# EasyEDA Pro project FKM3.epro, schematic Schematic2
Board Name: RfidScanner; Create Date: 2025-02-13; Page Name: P1; Project Name: fkm3; Schematic Name: Schematic2; Update Date: 2025-02-13; Company: EasyEDA.com; Drawn: EasyEDA; Page Size: A4; Part Number: JLCPCB-002; Reviewed: EasyEDA; Version: V0.1
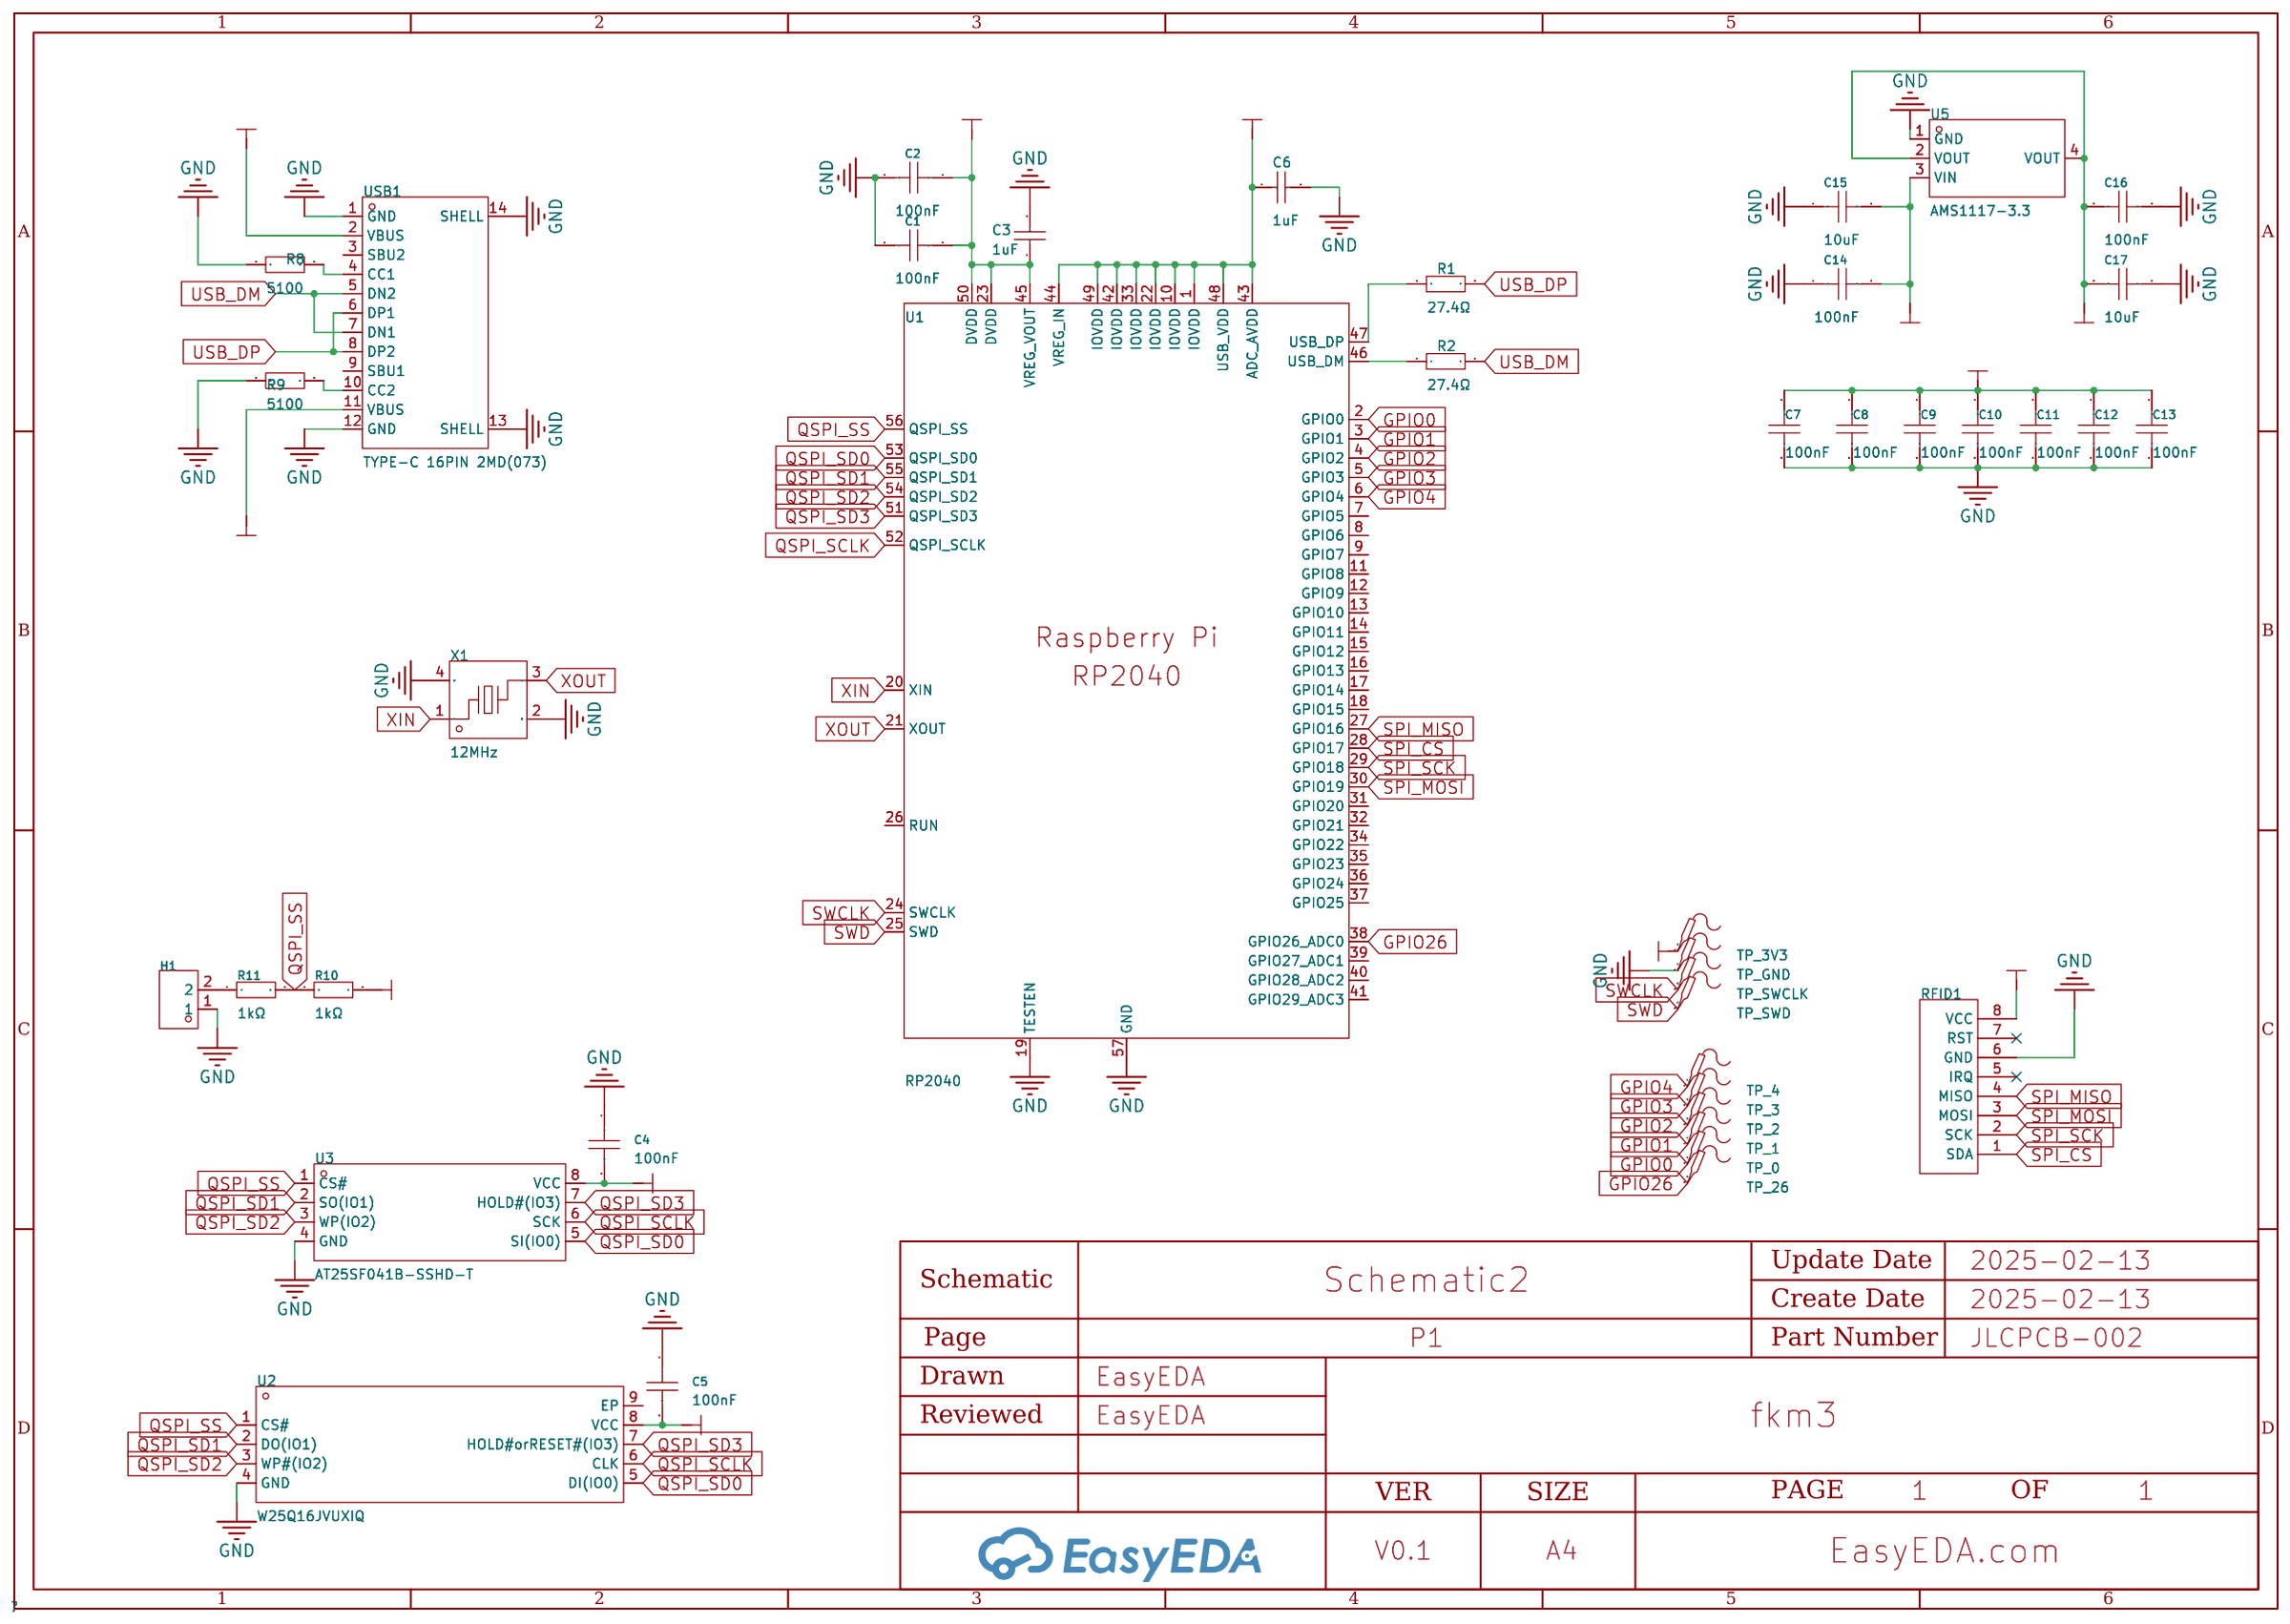
[diagram p2: schematic sheet]

## Parts
C1  100nF  [C0603]
C2  100nF  [C0603]
C3  1uF  [C0603]
C4  100nF  [C0603]
C5  100nF  [C0603]
C6  1uF  [C0603]
C7  100nF  [C0603]
C8  100nF  [C0603]
C9  100nF  [C0603]
C10  100nF  [C0603]
C11  100nF  [C0603]
C12  100nF  [C0603]
C13  100nF  [C0603]
C14  100nF  [C0603]
C15  10uF  [C0603]
C16  100nF  [C0603]
C17  10uF  [C0603]
H1  PZ254V-11-02P  [HDR-TH_2P-P2.54-V-M]
R1  27.4Ω  [R0402]
R2  27.4Ω  [R0402]
R8  5100  [R0603]
R9  5100  [R0603]
R10  1kΩ  [R0402]
R11  1kΩ  [R0402]
RFID1  -  [RFID-RC522-Board]
TP_0  -  [Test-Point-0.5mm]
TP_1  -  [Test-Point-0.5mm]
TP_2  -  [Test-Point-0.5mm]
TP_3  -  [Test-Point-0.5mm]
TP_3V3  -  [Test-Point-0.5mm]
TP_4  -  [Test-Point-0.5mm]
TP_26  -  [Test-Point-0.5mm]
TP_GND  -  [Test-Point-0.5mm]
TP_SWCLK  -  [Test-Point-0.5mm]
TP_SWD  -  [Test-Point-0.5mm]
U1  RP2040  [LQFN-56_L7.0-W7.0-P0.4-EP]
U2  W25Q16JVUXIQ  [USON-8_L3.0-W2.0-P0.50-BL-EP]
U3  AT25SF041B-SSHD-T  [SOIC-8_L4.9-W3.9-P1.27-LS6.0-BL]
U5  AMS1117-3.3  [SOT-223-3_L6.5-W3.4-P2.30-LS7.0-BR]
USB1  TYPE-C 16PIN 2MD(073)  [USB-C-SMD_TYPE-C-6PIN-2MD-073]
X1  12MHz  [CRYSTAL-SMD_4P-L3.2-W2.5-BL]

## Library data of the parts
C1 C2 C4 C5 C7-C14 C16 = CL10B104KB8NNNC: Capacitance: Tolerance:±10% Tolerance:±10% Voltage Rated: Temperature Coefficient:; LCSC Part Name: 100nF ±10% 50V; Supplier Part: C1591; Manufacturer: SAMSUNG(三星); Supplier Footprint: 0603; JLCPCB Part Class: Extended Part; Datasheet: https://atta.szlcsc.com/upload/public/pdf/source/20160218/1457707763339.pdf; Supplier: LCSC; Tolerance: ±10%
C3 C6 = CL10A105KA8NNNC: Capacitance: Tolerance:±10% Tolerance:±10% Voltage Rated: Temperature Coefficient:; LCSC Part Name: 1uF ±10% 25V; Supplier Part: C5673; Manufacturer: SAMSUNG(三星); Supplier Footprint: 0603; JLCPCB Part Class: Extended Part; Datasheet: https://atta.szlcsc.com/upload/public/pdf/source/20160218/1457707763339.pdf; Supplier: LCSC; Tolerance: ±10%
C15 C17 = CL10A106KP8NNNC: Capacitance: Tolerance:±10% Tolerance:±10% Voltage Rated: Temperature Coefficient:; LCSC Part Name: 10uF ±10% 10V; Supplier Part: C19702; Manufacturer: SAMSUNG(三星); Supplier Footprint: 0603; JLCPCB Part Class: Basic Part; Datasheet: https://atta.szlcsc.com/upload/public/pdf/source/20160218/1457707763339.pdf; Supplier: LCSC; Tolerance: ±10%
H1 = PZ254V-11-02P: Pin Structure:1x2P Pitch:2.54mm Row Spacing:- Circluar Pins/Square Pins:Square Pins Mounting Type:Straight Number of Rows:Plugin Number of Pins:2P Current Rating (Max):- Voltage Rating (Max):- Length of Mating Pin:6mm Insulation Height:2.5mm Length of End; LCSC Part Name: 间距:2.54mm 1x2P 直插 方针; Supplier Part: C492401; Manufacturer: XFCN(兴飞); Supplier Footprint: 插件,P=2.54mm; JLCPCB Part Class: Extended Part; Datasheet: https://atta.szlcsc.com/upload/public/pdf/source/20200309/C492401_A812433581A9B211A7FFA413ADDFF0E5.pdf; Supplier: LCSC; Pin Structure: 1x2P; Pitch: 2.54mm; Circluar Pins/Square Pins: Square Pins; Mounting Type: Straight; Number of Rows: Plugin; Number of Pins: 2P; Length of Mating Pin: 6mm; Insulation Height: 2.5mm; Length of End Connection Pin: 3mm; Operating Temperature Range: -40℃~+105℃; Color: Black
R1 R2 = RC0402FR-0727R4L: Type:Thick Film Resistors Resistance: Tolerance:±1% Tolerance:±1% Power(Watts): Overload Voltage (Max): Temperature Coefficient:±100ppm/℃ Temperature Coefficient:±100ppm/℃ Operating Temperature Range:-55℃~+155℃ Operating Temperature Range:-55℃~+155℃; LCSC Part Name: 厚膜电阻 27.4Ω ±1% 62.5mW; Supplier Part: C274349; Manufacturer: YAGEO(国巨); Supplier Footprint: 0402; JLCPCB Part Class: Extended Part; Datasheet: https://atta.szlcsc.com/upload/public/pdf/source/20180821/C275644_0D56F95EFF785E7D9A1FEF436B37DA78.pdf; Supplier: LCSC; Type: Thick Film Resistors; Tolerance: ±1%; Temperature Coefficient: ±100ppm/℃; Operating Temperature Range: -55℃~+155℃
R8 R9 = Res_0603: Supplier Footprint: 0603
R10 R11 = 0402WGF1001TCE: Type:Thick Film Resistors Resistance:1kΩ Tolerance:±1% Tolerance:±1% Power(Watts): Overload Voltage (Max): Temperature Coefficient:±100ppm/℃ Temperature Coefficient:±100ppm/℃ Operating Temperature Range:-55℃~+155℃ Operating Temperature Range:-55℃~+155℃; LCSC Part Name: 1kΩ ±1% 62.5mW 厚膜电阻; Supplier Part: C11702; Manufacturer: UNI-ROYAL(厚声); Supplier Footprint: 0402; JLCPCB Part Class: Basic Part; Datasheet: https://atta.szlcsc.com/upload/public/pdf/source/20200306/C422600_1E6D84923E4A46A82E41ADD87F860B5C.pdf; Supplier: LCSC; Type: Thick Film Resistors; Tolerance: ±1%; Temperature Coefficient: ±100ppm/℃; Operating Temperature Range: -55℃~+155℃
RFID1 = RFID-RC522-Board
TP_0-TP_3 TP_3V3 TP_4 TP_26 TP_GND TP_SWCLK TP_SWD = Test-Point: Test Point 测试点
U1 = RP2040_C2040: CPU Core:- RAM Size:264KB GPIO Ports Number:30 Operating Voltage Range:- Operating Voltage Range:- CPU Maximum Speed:133MHz Program Memory Type:- Operating Temperature Range:- Operating Temperature Range:- ADC (Bit):12bit DAC (Bit):- PWM (Bit):- 8Bit Time; LCSC Part Name: RP2040（RP2B2）; Supplier Part: C2040; Manufacturer: Raspberry Pi(树莓派); Supplier Footprint: LQFN-56(7x7); JLCPCB Part Class: Extended Part; Datasheet: https://atta.szlcsc.com/upload/public/pdf/source/20210621/C2040_96F425825606B7957D87DD32E2512CA9.pdf; Supplier: LCSC; RAM Size: 264KB; GPIO Ports Number: 30; CPU Maximum Speed: 133MHz; ADC (Bit): 12bit; UART/USART: 2; I2C: 2; SPI: 2; Universal Serial Bus: 有; Peripheral/Function: DMA；PWM; Direct Memory Access: 有
U2 = W25Q16JVUXIQ: Supplier Part: C2843335; Manufacturer: WINBOND(华邦); Supplier Footprint: USON-8-EP(2x3); JLCPCB Part Class: Extended Part; Datasheet: https://atta.szlcsc.com/upload/public/pdf/source/20210629/C2843335_FB4D78B5076715625DC0C83F790D3044.pdf; Supplier: LCSC
U3 = AT25SF041B-SSHD-T: Supplier Part: C5127618; Manufacturer: RENESAS(瑞萨)/IDT; Supplier Footprint: SOIC-8; JLCPCB Part Class: Extended Part; Datasheet: https://atta.szlcsc.com/upload/public/pdf/source/20220812/6FA76D54DDD5F49F6B0F271FB086CE90.pdf; Supplier: LCSC
U5 = AMS1117-3.3_C6186: Output Type: Maximum Input Voltage:- Output Voltage:3.3V Output Voltage:3.3V MAX Output Current:1A Power Supply Rejection Ratio (PSRR):72dB@(120Hz) Dropout Voltage:1.3V@(800mA) standby current:- Noise:- Feature:- Operating Temperature:- Operating Temperat; LCSC Part Name: 输出3.3V 1A; Supplier Part: C6186; Manufacturer: AMS; Supplier Footprint: SOT-223; JLCPCB Part Class: Basic Part; Datasheet: https://atta.szlcsc.com/upload/public/pdf/source/20180727/C6186_7A095716F0823C02F1997A905E26C086.pdf; Supplier: LCSC; Output Voltage: 3.3V; MAX Output Current: 1A; Power Supply Rejection Ratio (PSRR): 72dB@(120Hz); Dropout Voltage: 1.3V@(800mA); Output Polarity: Positive electrode; Number of Outputs: 1
USB1 = TYPE-C 16PIN 2MD(073): Connector Type:Type-C Standard:USB 3.1 Gender:Female Mounting Style:Horizontal attachment Number of Contacts:16P Number of Ports:1 Current Rating - Power (Max):5A Operating Temperature Range:-25℃~+85℃ Operating Temperature Range:-25℃~+85℃ Rated Voltage (M; LCSC Part Name: Type-C 母 卧贴; Supplier Part: C2765186; Manufacturer: SHOU HAN(首韩); Supplier Footprint: SMD; JLCPCB Part Class: Extended Part; Datasheet: https://atta.szlcsc.com/upload/public/pdf/source/20211123/39B17C16241EAC15C5E277BDA434118E.pdf; Supplier: LCSC; Connector Type: Type-C; Standard: USB 3.1; Gender: Female; Mounting Style: Horizontal attachment; Number of Contacts: 16P; Number of Ports: 1; Current Rating - Power (Max): 5A; Operating Temperature Range: -25℃~+85℃; Rated Voltage (Max): 5V; Connect-Disconnect Life: 5000 Cuts; Core Colour: Black
X1 = 3225-12.00-12-10-10/A: Crystal Type:贴片晶振 Frequency: Normal temperature Frequency Tolerance:±10ppm Normal temperature Frequency Tolerance:±10ppm External load capacitor: Frequency Stability(Full temperature range):±10ppm Frequency Stability(Full temperature range):±10ppm Equival; LCSC Part Name: 12MHz ±10ppm 12pF; Supplier Part: C518158; Manufacturer: LIMING(利明); Supplier Footprint: SMD3225-4P; JLCPCB Part Class: Extended Part; Datasheet: https://atta.szlcsc.com/upload/public/pdf/source/20200603/C518143_C28693AFC6B5677A46756E3C75F63174.pdf; Supplier: LCSC; Crystal Type: 贴片晶振; Normal temperature Frequency Tolerance: ±10ppm; Frequency Stability(Full temperature range): ±10ppm

## Nets
+1V1: C1.1 C2.1 C3.1 U1.23(DVDD) U1.45(VREG_VOUT) U1.50(DVDD)
+3V3: C4.2 C5.2 C6.2 C7.1 C8.1 C9.1 C10.1 C11.1 C12.1 C13.1 C16.2 C17.2 R10.2 RFID1.8(VCC) TP_3V3.1 U1.1(IOVDD) U1.10(IOVDD) U1.22(IOVDD) U1.33(IOVDD) U1.42(IOVDD) U1.43(ADC_AVDD) U1.44(VREG_IN) U1.48(USB_VDD) U1.49(IOVDD) U2.8(VCC) U3.8(VCC) U5.2(VOUT) U5.4(VOUT)
GND: C1.2 C2.2 C3.2 C4.1 C5.1 C6.1 C7.2 C8.2 C9.2 C10.2 C11.2 C12.2 C13.2 C14.1 C15.1 C16.1 C17.1 H1.1 R8.1 R9.1 RFID1.6(GND) TP_GND.1 U1.19(TESTEN) U1.57(GND) U2.4(GND) U3.4(GND) U5.1(GND) USB1.1(GND) USB1.12(GND) USB1.13(SHELL) USB1.14(SHELL) X1.2(GND) X1.4(GND)
GPIO0: TP_0.1 U1.2(GPIO0)
GPIO1: TP_1.1 U1.3(GPIO1)
GPIO2: TP_2.1 U1.4(GPIO2)
GPIO3: TP_3.1 U1.5(GPIO3)
GPIO4: TP_4.1 U1.6(GPIO4)
GPIO26: TP_26.1 U1.38(GPIO26_ADC0)
QSPI_SCLK: U1.52(QSPI_SCLK) U2.6(CLK) U3.6(SCK)
QSPI_SD0: U1.53(QSPI_SD0) U2.5(DI(IO0)) U3.5(SI(IO0))
QSPI_SD1: U1.55(QSPI_SD1) U2.2(DO(IO1)) U3.2(SO(IO1))
QSPI_SD2: U1.54(QSPI_SD2) U2.3(WP#(IO2)) U3.3(WP(IO2))
QSPI_SD3: U1.51(QSPI_SD3) U2.7(HOLD#orRESET#(IO3)) U3.7(HOLD#(IO3))
QSPI_SS: R10.1 R11.2 U1.56(QSPI_SS) U2.1(CS#) U3.1(CS#)
SPI_CS: RFID1.1(SDA) U1.28(GPIO17)
SPI_MISO: RFID1.4(MISO) U1.27(GPIO16)
SPI_MOSI: RFID1.3(MOSI) U1.30(GPIO19)
SPI_SCK: RFID1.2(SCK) U1.29(GPIO18)
SWCLK: TP_SWCLK.1 U1.24(SWCLK)
SWD: TP_SWD.1 U1.25(SWD)
USB_DM: R2.2 USB1.5(DN2) USB1.7(DN1)
USB_DP: R1.2 USB1.6(DP1) USB1.8(DP2)
VUSB: C14.2 C15.2 U5.3(VIN) USB1.2(VBUS) USB1.11(VBUS)
XIN: U1.20(XIN) X1.1
XOUT: U1.21(XOUT) X1.3
$1N1062: R1.1 U1.47(USB_DP)
$1N1101: R2.1 U1.46(USB_DM)
$1N1888: R8.2 USB1.4(CC1)
$1N1892: R9.2 USB1.10(CC2)
$1N2947: H1.2 R11.1

Not connected (* = marked no-connect by the designer): RFID1 5(IRQ)* 7(RST)*; U1 7(GPIO5) 8(GPIO6) 9(GPIO7) 11(GPIO8) 12(GPIO9) 13(GPIO10) 14(GPIO11) 15(GPIO12) 16(GPIO13) 17(GPIO14) 18(GPIO15) 26(RUN) 31(GPIO20) 32(GPIO21) 34(GPIO22) 35(GPIO23) 36(GPIO24) 37(GPIO25) 39(GPIO27_ADC1) 40(GPIO28_ADC2) 41(GPIO29_ADC3); U2 9(EP); USB1 3(SBU2) 9(SBU1)
